# EAGLE design mcp73123-breakout01 (EAGLE 6.2)
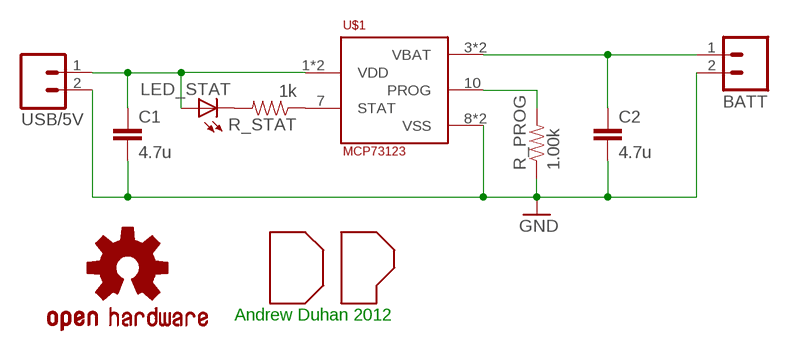
[diagram p0: schematic, sheet 1]

## Parts
BATT  M02PTH  [1X02]
C1  4.7u  CAP0603-CAP  [0603-CAP]
C2  4.7u  CAP0603-CAP  [0603-CAP]
LED_STAT  LED1206  [LED-1206]
R_PROG  1.00k  RESISTOR0603-RES  [0603-RES]
R_STAT  1k  RESISTOR0603-RES  [0603-RES]
U$1  MCP73123  [VDFN10]
U$2  DP_LOGO  [DP_LOGO]
U$3  OSHW-LOGOS  [OSHW-LOGO-S]
USB/5V  M02PTH  [1X02]

## Nets
GND: BATT.2 C1.2 C2.2 R_PROG.1 U$1.8(VSS) U$1.9(VSS) USB/5V.2
N$1: C1.1 LED_STAT.A U$1.1(VDD) U$1.2(VDD) USB/5V.1
N$2: R_STAT.1 U$1.7(STAT)
N$3: R_PROG.2 U$1.10(PROG)
N$5: LED_STAT.C R_STAT.2
N$6: BATT.1 C2.1 U$1.3(VBAT) U$1.4(VBAT)

## Notes on the sheet
- Andrew Duhan 2012

## Library data of the parts
BATT USB/5V = SparkFun-Connectors:M02: Header 2 Standard 2-pin 0.1" header. Use with straight break away headers (SKU : PRT-00116), right angle break away headers (PRT-00553), swiss pins (PRT-00743), machine pins (PRT-00117), and female headers (PRT-00115). Molex polarized connector foot print use with SKU : PRT-08233 with associated crimp pins and housings.
C1 C2 = SparkFun-Passives:CAP: Capacitor Standard 0603 ceramic capacitor, and 0.1" leaded capacitor.
LED_STAT = SparkFun-LED:LED: LEDs Standard schematic elements and footprints for 5mm, 3mm, 1206, and 0603 sized LEDs. 5mm - Spark Fun Electronics SKU : COM-00529 (and others)
R_PROG R_STAT = SparkFun-Passives:RESISTOR: Resistor Basic schematic elements and footprints for 0603, 1206, and PTH resistors.
U$1 = myparts:MCP73123
U$2 = myparts:DP_LOGO: Duhan Power! logo
U$3 = SparkFun-Aesthetics:OSHW-LOGO: Open Source Hardware Logo This logo indicates the piece of hardware it is found on incorporates a OSHW license and/or adheres to the definition of open source hardware found here: http://freedomdefined.org/OSHW

## Board
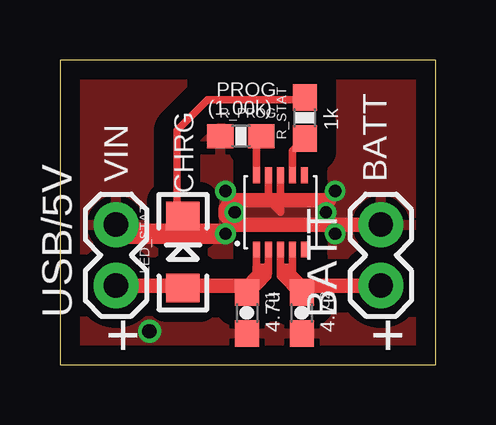
[diagram p1: board, top side]
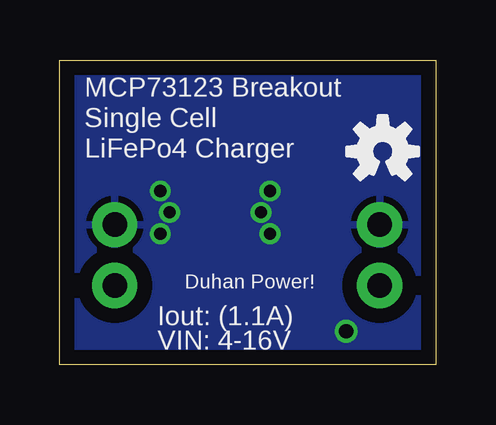
[diagram p2: board, bottom side, seen from below]

Size 15.67 x 12.69 mm. Coordinates in mm from the lower left corner, seen from the top.
Outline: 15.67,12.69 0,12.69 0,0 15.67,0 15.67,12.69
Copper layers (1*16): Top 0.0356mm / dielectric 1.5011mm / Bottom 0.0356mm
Design rules: minimum track width 6mil, minimum drill 13mil, track to track 6mil, track to pad 6mil, pad to pad 6mil, via to via 6mil, smd to smd 6mil, copper to edge 15mil, drill to drill 6mil, minimum pad ring 7mil, minimum via ring 7mil, stop-mask expansion 4mil, vias tented up to drill 24mil, thermal gap 10mil

### Footprints (pad centres in the part's own frame; a part is rotated, then mirrored left to right if it is on the bottom)
1X02 = drill 1.016 pad 1.88: 1 0,0; 2 2.54,0
0603-CAP = smd 1.1 x 1: 1 -0.85,0; 2 0.85,0
LED-1206 = smd 1.2 x 1.4: A -1.5,0; C 1.5,0
0603-RES = smd 1.1 x 1: 1 -0.85,0; 2 0.85,0
VDFN10 = smd 0.3 x 0.65: 1 -1,-1.55; 2 -0.5,-1.55; 3 0,-1.55; 4 0.5,-1.55; 5 1,-1.55; 6 1,1.55; 7 0.5,1.55; 8 0,1.55; 9 -0.5,1.55; 10 -1,1.55

### Placement (x,y rotation side)
BATT  13.39,3.29 90 top
C1  7.8,2.15 270 top
C2  10.08,2.15 270 top
LED_STAT  5.13,4.69 90 top
R_PROG  7.54,9.52 0 top
R_STAT  10.21,10.28 90 top
U$1  9.2,6.34 0 top
U$2  7.67,6.09 0 bottom
U$3  2.21,8.88 0 bottom
USB/5V  2.34,3.29 90 top

### Tracks (layer width: path | path; a pad name or v marks a point on that pad's centre or on a via)
GND  (via drill 0.51, 0.6)
  Top 0.305: U$1.8 9.2,6.34 8.7,6.84 U$1.9
  Top 0.61: 11.23,6.85 7.16,6.85 6.91,6.47 6.91,6.21 7.29,5.83 BATT.2 | 6.66,5.58 2.34,5.58 | USB/5V.2 2.34,5.58 | 2.34,5.58 2.34,5.32 6.91,5.32
  other vias: 3.73,1.39 11.1,6.34 7.29,6.34 6.91,5.45 6.91,7.23 11.48,5.45 11.48,7.23
  pour Top (isolate 0.813): 15.67,-0.01 -0.08,-0.01 -0.08,12.69 15.67,12.69
  pour Bottom (isolate 0.61): 15.67,-0.01 -0.08,-0.01 -0.08,12.69 15.67,12.69
N$1
  Top 0.305: U$1.1 8.2,3.4 C1.1 8.7,3.9 | U$1.2 8.7,3.9 | 8.69,4.18 8.69,3.8 | 8.69,3.8 8.69,3.67 8.31,3.29 | 8.31,3.29 8.05,3.04 8.18,3.8 | 8.31,3.29 8.56,4.05 8.18,4.05 8.18,3.8 | 8.18,3.8 7.67,3.29 | 8.7,3.9 8.7,3.81 8.69,3.8
  Top 0.61: 7.76,3.04 C1.1 7.89,3.29 5.51,3.29 | USB/5V.1 5.51,3.29 | LED_STAT.A 5.13,3.17 5.51,3.29
N$2
  Top 0.305: U$1.7 9.7,8.91 R_STAT.1
N$3
  Top 0.305: U$1.10 8.2,9.44 R_PROG.2
N$5
  Top 0.305: R_STAT.2 9.96,11.04 6.15,11.04 4.88,9.77 4.88,6.72 5.16,6.19 LED_STAT.C
N$6
  Top 0.305: 9.96,2.78 9.96,2.91 9.2,3.67 9.2,3.89 | U$1.4 9.7,3.39 C2.1 9.2,3.89 | U$1.3 9.2,4.05 | 9.2,4.05 9.2,3.89 | 9.2,4.05 9.45,4.05 | 9.58,4.05 9.45,4.05 | 9.45,4.05 10.21,3.29
  Top 0.61: BATT.1 10,3.29 C2.1

### Text on the board
tPlace: CHRG | PROG | (1.00k) | 1k | VIN | BATT | 4.7u | 4.7u | + | +
bPlace: MCP73123 Breakout | Single Cell | LiFePo4 Charger | Duhan Power! | Iout: (1.1A) | VIN: 4-16V